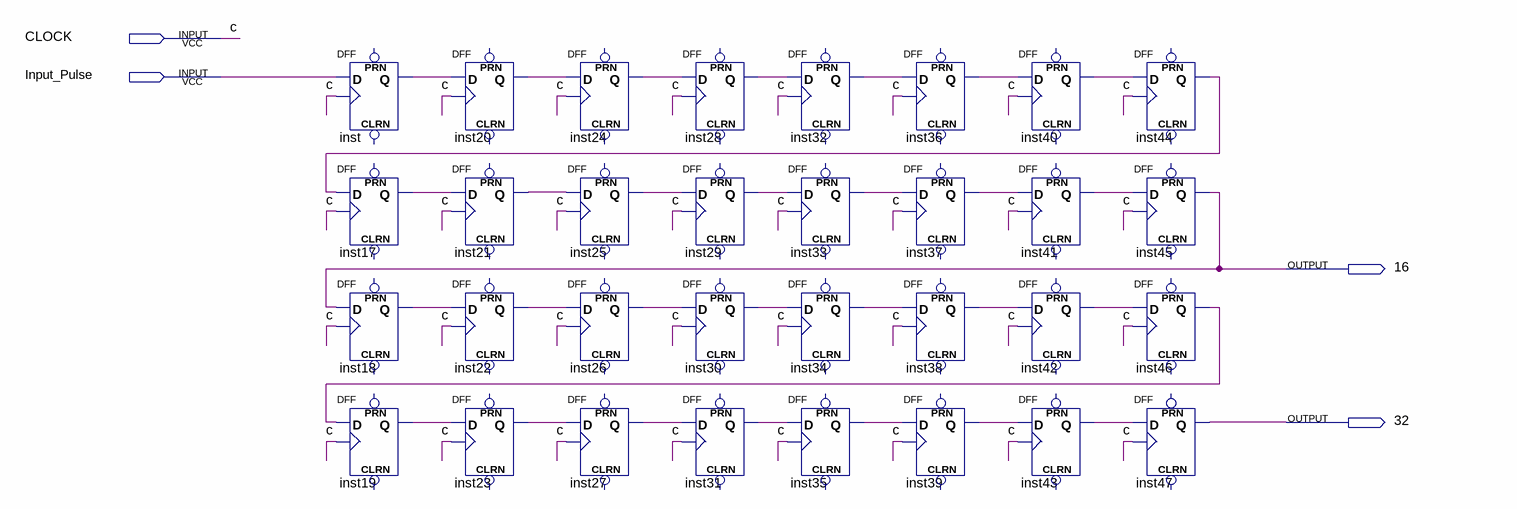
[diagram p0: schematic sheet]
// Quartus schematic Delay_Function.bdf as structural Verilog: 32 symbols, 4 pins
module Delay_Function (
  input  CLOCK,
  input  Input_Pulse,
  output \16 ,
  output \32 
);

  wire inst17_q, inst18_q, inst19_q, inst20_q, inst21_q, inst22_q, inst23_q, inst24_q, inst25_q, inst26_q,
       inst27_q, inst28_q, inst29_q, inst30_q, inst31_q, inst32_q, inst33_q, inst34_q, inst35_q, inst36_q,
       inst37_q, inst38_q, inst39_q, inst40_q, inst41_q, inst42_q, inst43_q, inst44_q, inst46_q, inst_q;

  DFF inst (.CLK(CLOCK), .D(Input_Pulse), .Q(inst_q));  // open: CLRN, PRN
  DFF inst17 (.CLK(CLOCK), .D(inst44_q), .Q(inst17_q));  // open: CLRN, PRN
  DFF inst18 (.CLK(CLOCK), .D(\16 ), .Q(inst18_q));  // open: CLRN, PRN
  DFF inst19 (.CLK(CLOCK), .D(inst46_q), .Q(inst19_q));  // open: CLRN, PRN
  DFF inst20 (.CLK(CLOCK), .D(inst_q), .Q(inst20_q));  // open: CLRN, PRN
  DFF inst21 (.CLK(CLOCK), .D(inst17_q), .Q(inst21_q));  // open: CLRN, PRN
  DFF inst22 (.CLK(CLOCK), .D(inst18_q), .Q(inst22_q));  // open: CLRN, PRN
  DFF inst23 (.CLK(CLOCK), .D(inst19_q), .Q(inst23_q));  // open: CLRN, PRN
  DFF inst24 (.CLK(CLOCK), .D(inst20_q), .Q(inst24_q));  // open: CLRN, PRN
  DFF inst25 (.CLK(CLOCK), .D(inst21_q), .Q(inst25_q));  // open: CLRN, PRN
  DFF inst26 (.CLK(CLOCK), .D(inst22_q), .Q(inst26_q));  // open: CLRN, PRN
  DFF inst27 (.CLK(CLOCK), .D(inst23_q), .Q(inst27_q));  // open: CLRN, PRN
  DFF inst28 (.CLK(CLOCK), .D(inst24_q), .Q(inst28_q));  // open: CLRN, PRN
  DFF inst29 (.CLK(CLOCK), .D(inst25_q), .Q(inst29_q));  // open: CLRN, PRN
  DFF inst30 (.CLK(CLOCK), .D(inst26_q), .Q(inst30_q));  // open: CLRN, PRN
  DFF inst31 (.CLK(CLOCK), .D(inst27_q), .Q(inst31_q));  // open: CLRN, PRN
  DFF inst32 (.CLK(CLOCK), .D(inst28_q), .Q(inst32_q));  // open: CLRN, PRN
  DFF inst33 (.CLK(CLOCK), .D(inst29_q), .Q(inst33_q));  // open: CLRN, PRN
  DFF inst34 (.CLK(CLOCK), .D(inst30_q), .Q(inst34_q));  // open: CLRN, PRN
  DFF inst35 (.CLK(CLOCK), .D(inst31_q), .Q(inst35_q));  // open: CLRN, PRN
  DFF inst36 (.CLK(CLOCK), .D(inst32_q), .Q(inst36_q));  // open: CLRN, PRN
  DFF inst37 (.CLK(CLOCK), .D(inst33_q), .Q(inst37_q));  // open: CLRN, PRN
  DFF inst38 (.CLK(CLOCK), .D(inst34_q), .Q(inst38_q));  // open: CLRN, PRN
  DFF inst39 (.CLK(CLOCK), .D(inst35_q), .Q(inst39_q));  // open: CLRN, PRN
  DFF inst40 (.CLK(CLOCK), .D(inst36_q), .Q(inst40_q));  // open: CLRN, PRN
  DFF inst41 (.CLK(CLOCK), .D(inst37_q), .Q(inst41_q));  // open: CLRN, PRN
  DFF inst42 (.CLK(CLOCK), .D(inst38_q), .Q(inst42_q));  // open: CLRN, PRN
  DFF inst43 (.CLK(CLOCK), .D(inst39_q), .Q(inst43_q));  // open: CLRN, PRN
  DFF inst44 (.CLK(CLOCK), .D(inst40_q), .Q(inst44_q));  // open: CLRN, PRN
  DFF inst45 (.CLK(CLOCK), .D(inst41_q), .Q(\16 ));  // open: CLRN, PRN
  DFF inst46 (.CLK(CLOCK), .D(inst42_q), .Q(inst46_q));  // open: CLRN, PRN
  DFF inst47 (.CLK(CLOCK), .D(inst43_q), .Q(\32 ));  // open: CLRN, PRN

  // Other names for the same wires on the sheet: c = CLOCK
endmodule
